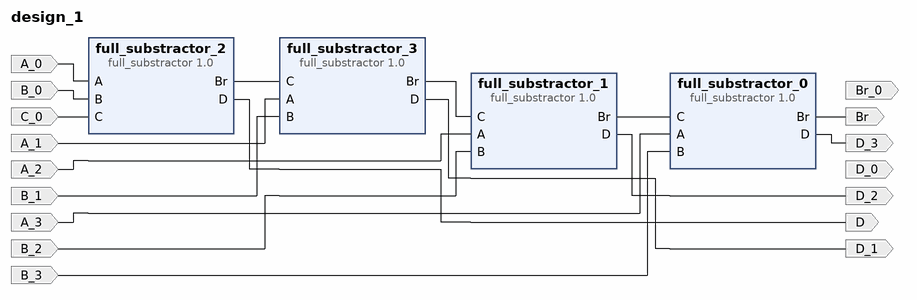
[diagram p0: block diagram of the top level]
# Vivado block design design_1, xc7z020clg484-1, Vivado 2023.2
create_bd_design design_1

create_bd_port -dir O D_0
create_bd_port -dir O Br_0
create_bd_port -dir I C_0
create_bd_port -dir I B_0
create_bd_port -dir I A_0
create_bd_port -dir O D
create_bd_port -dir I B_1
create_bd_port -dir I A_1
create_bd_port -dir O D_1
create_bd_port -dir I B_2
create_bd_port -dir I A_2
create_bd_port -dir O D_2
create_bd_port -dir I B_3
create_bd_port -dir I A_3
create_bd_port -dir O D_3
create_bd_port -dir O Br

create_bd_cell -type ip -vlnv xilinx.com:user:full_substractor:1.0 full_substractor_0
create_bd_cell -type ip -vlnv xilinx.com:user:full_substractor:1.0 full_substractor_1
create_bd_cell -type ip -vlnv xilinx.com:user:full_substractor:1.0 full_substractor_2
create_bd_cell -type ip -vlnv xilinx.com:user:full_substractor:1.0 full_substractor_3

# ---- connections ----

connect_bd_net -net A_0_1 [get_bd_ports A_0] [get_bd_pins full_substractor_2/A]
connect_bd_net -net A_1_1 [get_bd_ports A_1] [get_bd_pins full_substractor_3/A]
connect_bd_net -net A_2_1 [get_bd_ports A_2] [get_bd_pins full_substractor_1/A]
connect_bd_net -net A_3_1 [get_bd_ports A_3] [get_bd_pins full_substractor_0/A]
connect_bd_net -net B_0_1 [get_bd_ports B_0] [get_bd_pins full_substractor_2/B]
connect_bd_net -net B_1_1 [get_bd_ports B_1] [get_bd_pins full_substractor_3/B]
connect_bd_net -net B_2_1 [get_bd_ports B_2] [get_bd_pins full_substractor_1/B]
connect_bd_net -net B_3_1 [get_bd_ports B_3] [get_bd_pins full_substractor_0/B]
connect_bd_net -net C_0_1 [get_bd_ports C_0] [get_bd_pins full_substractor_2/C]
connect_bd_net [get_bd_pins full_substractor_0/Br] [get_bd_ports Br]
connect_bd_net [get_bd_pins full_substractor_0/D] [get_bd_ports D_3]
connect_bd_net [get_bd_pins full_substractor_1/Br] [get_bd_pins full_substractor_0/C]
connect_bd_net [get_bd_pins full_substractor_1/D] [get_bd_ports D_2]
connect_bd_net [get_bd_pins full_substractor_2/Br] [get_bd_pins full_substractor_3/C]
connect_bd_net [get_bd_pins full_substractor_2/D] [get_bd_ports D]
connect_bd_net [get_bd_pins full_substractor_3/Br] [get_bd_pins full_substractor_1/C]
connect_bd_net [get_bd_pins full_substractor_3/D] [get_bd_ports D_1]

validate_bd_design
save_bd_design
